# EAGLE design pcb_univ_3-(1-3-5)-x-x-rev5 (EAGLE 9.6.2)
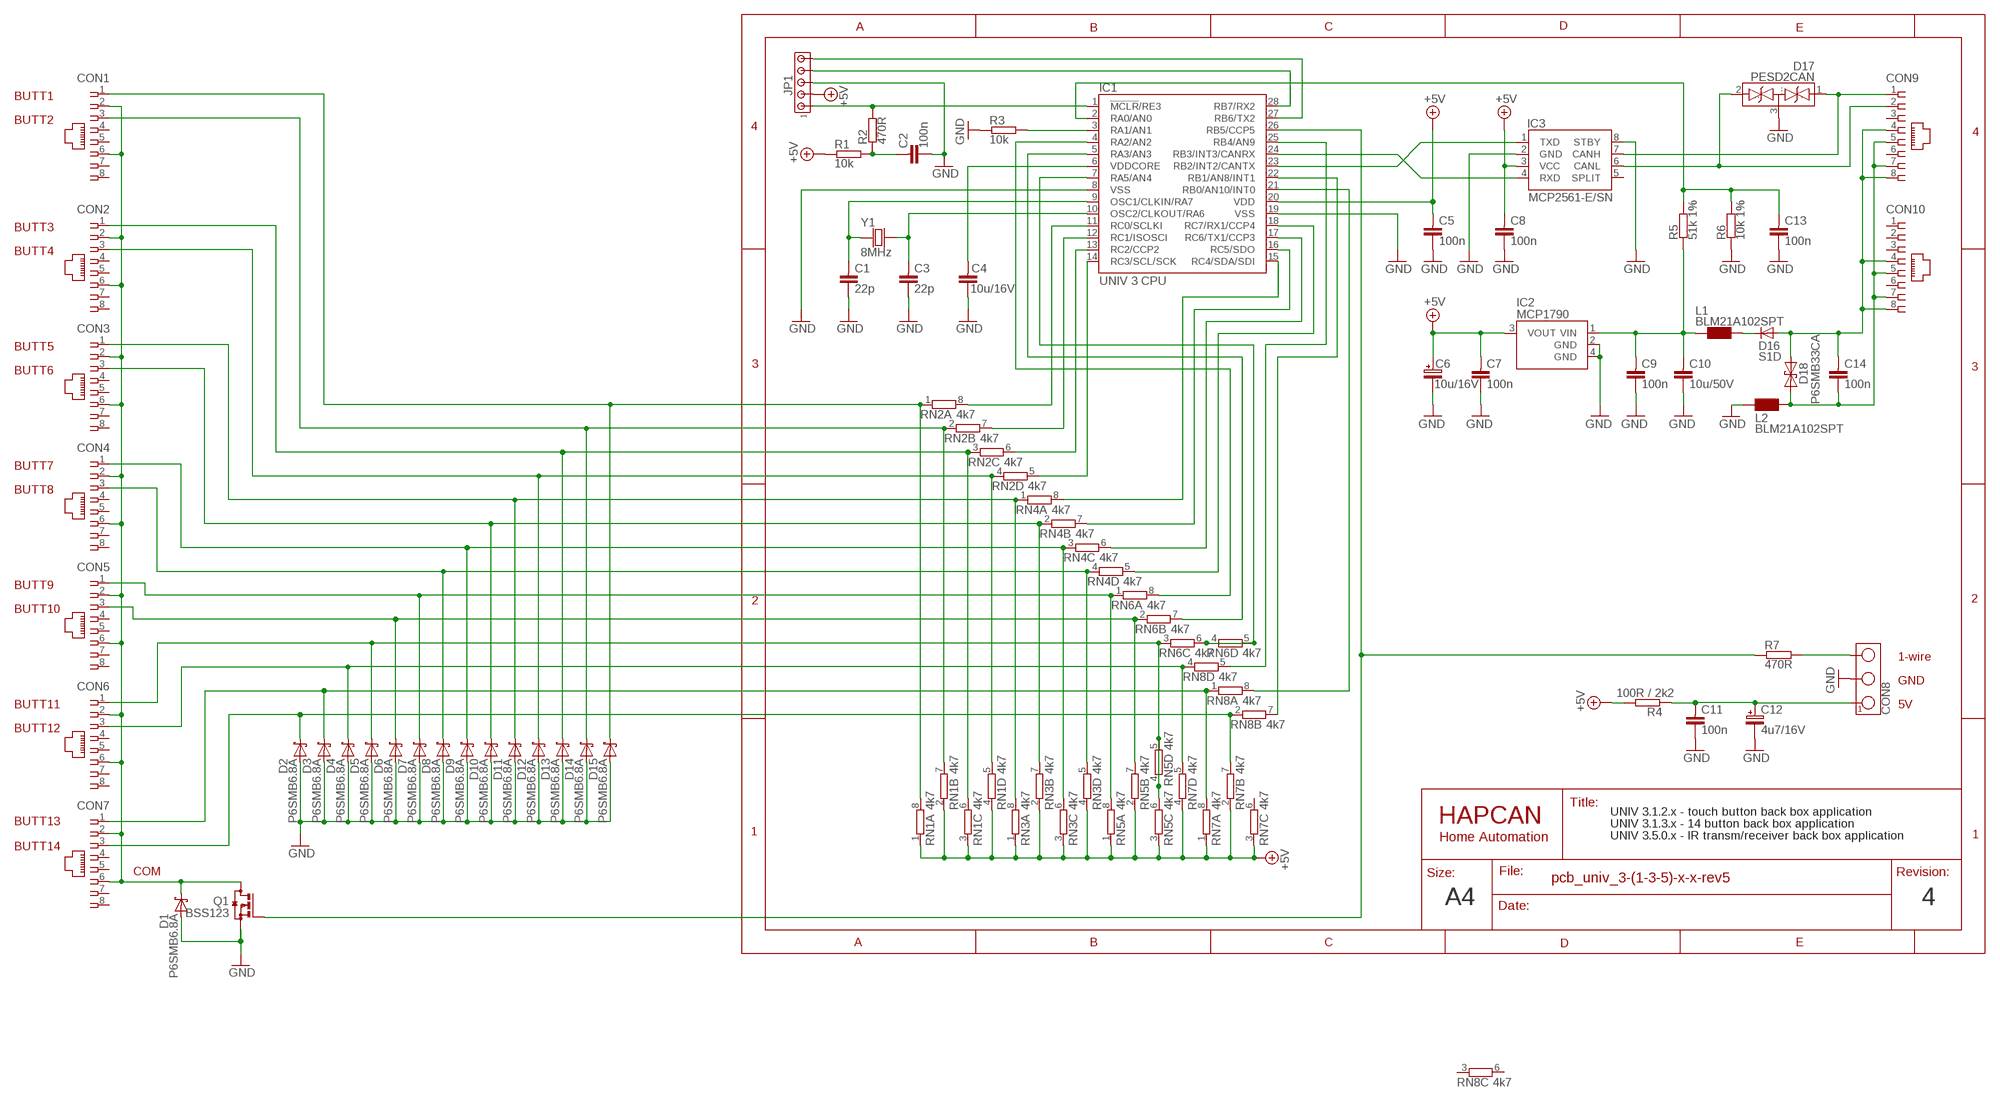
[diagram p0: schematic, sheet 1]

## Parts
C1  22p  CAPACITOR0805  [0805]
C2  100n  CAPACITOR0805  [0805]
C3  22p  CAPACITOR0805  [0805]
C4  10u/16V  CAPACITOR0805  [0805]
C5  100n  CAPACITOR0805  [0805]
C6  10u/16V  CAPACITOR-POLARIZED-SMC_B  [SMC_B]
C7  100n  CAPACITOR0805  [0805]
C8  100n  CAPACITOR0805  [0805]
C9  100n  CAPACITOR0805  [0805]
C10  10u/50V  CAPACITOR1210  [1210]
C11  100n  CAPACITOR0805  [0805]
C12  4u7/16V  CAPACITOR-POLARIZED-SMC_B  [SMC_B]
C13  100n  CAPACITOR0805  [0805]
C14  100n  CAPACITOR0805  [0805]
CON1  RJ45-SOCKET  [RJ45-PCB-SOCKET]
CON2  RJ45-SOCKET  [RJ45-PCB-SOCKET]
CON3  RJ45-SOCKET  [RJ45-PCB-SOCKET]
CON4  RJ45-SOCKET  [RJ45-PCB-SOCKET]
CON5  RJ45-SOCKET  [RJ45-PCB-SOCKET]
CON6  RJ45-SOCKET  [RJ45-PCB-SOCKET]
CON7  RJ45-SOCKET  [RJ45-PCB-SOCKET]
CON8  TERMINAL-3  TERMINAL-3-5X10.5MM  [ARK3-5X10.5MM]
CON9  RJ45-SOCKET  [RJ45-PCB-SOCKET]
CON10  RJ45-SOCKET  [RJ45-PCB-SOCKET]
D1  P6SMB6.8A  DIODE_TRANSIL1_DO214  [DO-214]
D2  P6SMB6.8A  DIODE_TRANSIL1_DO214  [DO-214]
D3  P6SMB6.8A  DIODE_TRANSIL1_DO214  [DO-214]
D4  P6SMB6.8A  DIODE_TRANSIL1_DO214  [DO-214]
D5  P6SMB6.8A  DIODE_TRANSIL1_DO214  [DO-214]
D6  P6SMB6.8A  DIODE_TRANSIL1_DO214  [DO-214]
D7  P6SMB6.8A  DIODE_TRANSIL1_DO214  [DO-214]
D8  P6SMB6.8A  DIODE_TRANSIL1_DO214  [DO-214]
D9  P6SMB6.8A  DIODE_TRANSIL1_DO214  [DO-214]
D10  P6SMB6.8A  DIODE_TRANSIL1_DO214  [DO-214]
D11  P6SMB6.8A  DIODE_TRANSIL1_DO214  [DO-214]
D12  P6SMB6.8A  DIODE_TRANSIL1_DO214  [DO-214]
D13  P6SMB6.8A  DIODE_TRANSIL1_DO214  [DO-214]
D14  P6SMB6.8A  DIODE_TRANSIL1_DO214  [DO-214]
D15  P6SMB6.8A  DIODE_TRANSIL1_DO214  [DO-214]
D16  S1D  DIODE_DO-214  [DO-214]
D17  PESD2CAN  PESD2CANSOT-23  [SOT-23]
D18  P6SMB33CA  DIODE_TRANSIL2  [DO-214_TRANSIL2]
IC1  UNIV 3 CPU  UNIV3CPU-I/SO  [UNIV3CPU]
IC2  MCP1790  [SOT-223]
IC3  MCP2561-E/SN  [SO-08]
JP1  HEADER5  [SIP-5]
L1  BLM21A102SPT  BLMXXX  [0805@1]
L2  BLM21A102SPT  BLMXXX  [0805@1]
Q1  BSS123  [SOT23]
R1  10k  RESISTOR0805  [0805]
R2  470R  RESISTOR0805  [0805]
R3  10k  RESISTOR0805  [0805]
R4  100R / 2k2  RESISTOR0805  [0805]
R5  51k 1%  RESISTOR0805  [0805]
R6  10k 1%  RESISTOR0805  [0805]
R7  470R  RESISTOR0805  [0805]
RN1  4k7  4R-NEXB38V  [EXB38V]
RN2  4k7  4R-NEXB38V  [EXB38V]
RN3  4k7  4R-NEXB38V  [EXB38V]
RN4  4k7  4R-NEXB38V  [EXB38V]
RN5  4k7  4R-NEXB38V  [EXB38V]
RN6  4k7  4R-NEXB38V  [EXB38V]
RN7  4k7  4R-NEXB38V  [EXB38V]
RN8  4k7  4R-NEXB38V  [EXB38V]
Y1  8MHz  CRYSTAL-HC49V  [CRYSTAL-HC49V]

## Nets
+5V: C5.1 C6.+ C7.1 C8.1 IC1.20(VDD) IC2.3(VOUT) IC3.3(VCC) JP1.2 R1.1 R4.1 RN1.1 RN1.2 RN1.3 RN1.4 RN3.1 RN3.2 RN3.3 RN3.4 RN5.1 RN5.2 RN5.3 RN7.1 RN7.2 RN7.3 RN7.4
GND: C1.2 C2.2 C3.2 C4.2 C5.2 C6.- C7.2 C8.2 C9.2 C10.2 C11.2 C12.- C13.2 CON8.2 D1.A D2.A D3.A D4.A D5.A D6.A D7.A D8.A D9.A D10.A D11.A D12.A D13.A D14.A D15.A D17.3(...) IC1.8(VSS) IC1.19(VSS) IC2.2(GND) IC2.4(GND) IC3.2(GND) IC3.8(STBY) JP1.3 L2.1 Q1.2(S) R3.1 R6.1
N$1: IC1.26(RB5/CCP5) Q1.1(G) R7.1
N$2: IC1.24(RB3/INT3/CANRX) IC3.4(RXD)
N$3: IC1.23(RB2/INT2/CANTX) IC3.1(TXD)
N$4: IC1.7(RA5/AN4) RN6.4 RN6.5 RN6.6
N$5: CON1.1 D15.C RN1.8 RN2.1
N$6: CON2.1 D13.C RN1.6 RN2.3
N$7: C2.1 R1.2 R2.1
N$8: IC1.1(!MCLR!/RE3) JP1.1 R2.2
N$9: CON9.1 D17.1(.) IC3.7(CANH)
N$10: IC1.28(RB7/RX2) JP1.4
N$11: IC1.22(RB1/AN8/INT1) RN8.7
N$12: IC1.3(RA1/AN1) R3.2
N$13: CON5.1 D7.C RN5.8 RN6.1
N$14: IC1.27(RB6/TX2) JP1.5
N$15: C3.1 IC1.10(OSC2/CLKOUT/RA6) Y1.2
N$16: C13.1 IC1.2(RA0/AN0) R5.2 R6.2
N$17: C9.1 C10.1 IC2.1(VIN) L1.1 R5.1
N$18: IC1.21(RB0/AN10/INT0) RN8.8
N$19: CON1.3 D14.C RN1.7 RN2.2
N$20: IC1.25(RB4/AN9) RN8.5
N$21: CON2.3 D12.C RN1.5 RN2.4
N$22: IC1.14(RC3/SCL/SCK) RN2.5
N$23: CON3.3 D10.C RN3.7 RN4.2
N$24: CON4.1 D9.C RN3.6 RN4.3
N$25: IC1.11(RC0/SCLKI) RN2.8
N$26: IC1.12(RC1/ISOSCI) RN2.7
N$27: IC1.13(RC2/CCP2) RN2.6
N$28: CON5.3 D6.C RN5.7 RN6.2
N$29: IC1.15(RC4/SDA/SDI) RN4.8
N$30: CON8.3 R7.2
N$31: CON3.1 D11.C RN3.8 RN4.1
N$32: CON4.3 D8.C RN3.5 RN4.4
N$33: IC1.5(RA3/AN3) RN6.7
N$34: IC1.4(RA2/AN2) RN6.8
N$36: CON6.1 D5.C RN5.4 RN5.5 RN5.6 RN6.3
N$37: C11.1 C12.+ CON8.1 R4.2
N$38: CON6.3 D4.C RN7.5 RN8.4
N$39: C14.2 CON9.5 CON9.7 CON10.5 CON10.7 D18.C L2.2
N$40: C1.1 IC1.9(OSC1/CLKIN/RA7) Y1.1
N$41: CON7.3 D2.C RN7.7 RN8.2
N$42: CON9.2 D17.2(..) IC3.6(CANL)
N$45: IC1.16(RC5/SDO) RN4.7
N$46: IC1.17(RC6/TX1/CCP3) RN4.6
N$47: IC1.18(RC7/RX1/CCP4) RN4.5
N$48: CON7.1 D3.C RN7.8 RN8.1
N$51: CON1.2 CON1.6 CON2.2 CON2.6 CON3.2 CON3.6 CON4.2 CON4.6 CON5.2 CON5.6 CON6.2 CON6.6 CON7.2 CON7.6 D1.C Q1.3(D)
N$56: C4.1 IC1.6(VDDCORE)
N$64: C14.1 CON9.4 CON9.8 CON10.4 CON10.8 D16.A D18.A
N$67: D16.C L1.2
Unconnected: CON1.4 CON1.5 CON1.7 CON1.8 CON2.4 CON2.5 CON2.7 CON2.8 CON3.4 CON3.5 CON3.7 CON3.8 CON4.4 CON4.5 CON4.7 CON4.8 CON5.4 CON5.5 CON5.7 CON5.8 CON6.4 CON6.5 CON6.7 CON6.8 CON7.4 CON7.5 CON7.7 CON7.8 CON9.3 CON9.6 CON10.1 CON10.2 CON10.3 CON10.6 IC3.5(SPLIT) RN7.6 RN8.3 RN8.6

## Notes on the sheet
- BUTT1
- BUTT2
- BUTT3
- BUTT4
- BUTT5
- BUTT6
- BUTT7
- BUTT8
- BUTT9
- BUTT10
- 1-wire
- GND
- BUTT11 | 5V
- BUTT12
- UNIV 3.1.2.x - touch button back box application
- BUTT13 | UNIV 3.1.3.x - 14 button back box application
- UNIV 3.5.0.x - IR transm/receiver back box application
- BUTT14
- COM
- A4 | 4

## Library data of the parts
C1-C5 C7-C11 C13 C14 = HAPCAN_devices - UNIV3:CAPACITOR: HAPCAN Capacitor
C6 C12 = HAPCAN_devices - UNIV3:CAPACITOR-POLARIZED: HAPCAN Polarazied Capacitor
CON1-CON7 CON9 CON10 = HAPCAN_devices - UNIV3:RJ45-SOCKET: HAPCAN RJ45 socket
CON8 = HAPCAN_devices - UNIV3:TERMINAL-3: HAPCAN Terminal Block - 3 way
D1-D15 = HAPCAN_devices - UNIV3:DIODE_TRANSIL1: HAPCAN Unidirectional transil diode
D16 = HAPCAN_devices - UNIV3:DIODE: HAPCAN Rectifier Diode
D17 = HAPCAN_devices - UNIV3:PESD2CAN: CAN bus ESD protection diode
D18 = HAPCAN_devices - UNIV3:DIODE_TRANSIL2: HAPCAN Bidirectional transil diode
IC1 = HAPCAN_devices - UNIV3:UNIV3CPU: HAPCAN Microcontroller UNIV 3 CPU
IC2 = HAPCAN_devices - UNIV3:MCP1790: 70 mA, High Voltage Regulator
IC3 = HAPCAN_devices - UNIV3:MCP2561: HAPCAN CAN Tranceiver
JP1 = HAPCAN_devices - UNIV3:HEADER5: HAPCAN Header 5
L1 L2 = HAPCAN_devices - UNIV3:BLMXXX: Choke
Q1 = transistor-small-signal:BSS123: N-CHANNEL MOS FET
R1-R7 = HAPCAN_devices - UNIV3:RESISTOR: HAPCAN Resistor
RN1-RN8 = resistor-dil:4R-N: Array Chip Resistor Source: RS Component / Phycomp; OC_FARNELL: unknown; OC_NEWARK: unknown
Y1 = HAPCAN_devices - UNIV3:CRYSTAL: HAPCAN Crystal

## Board
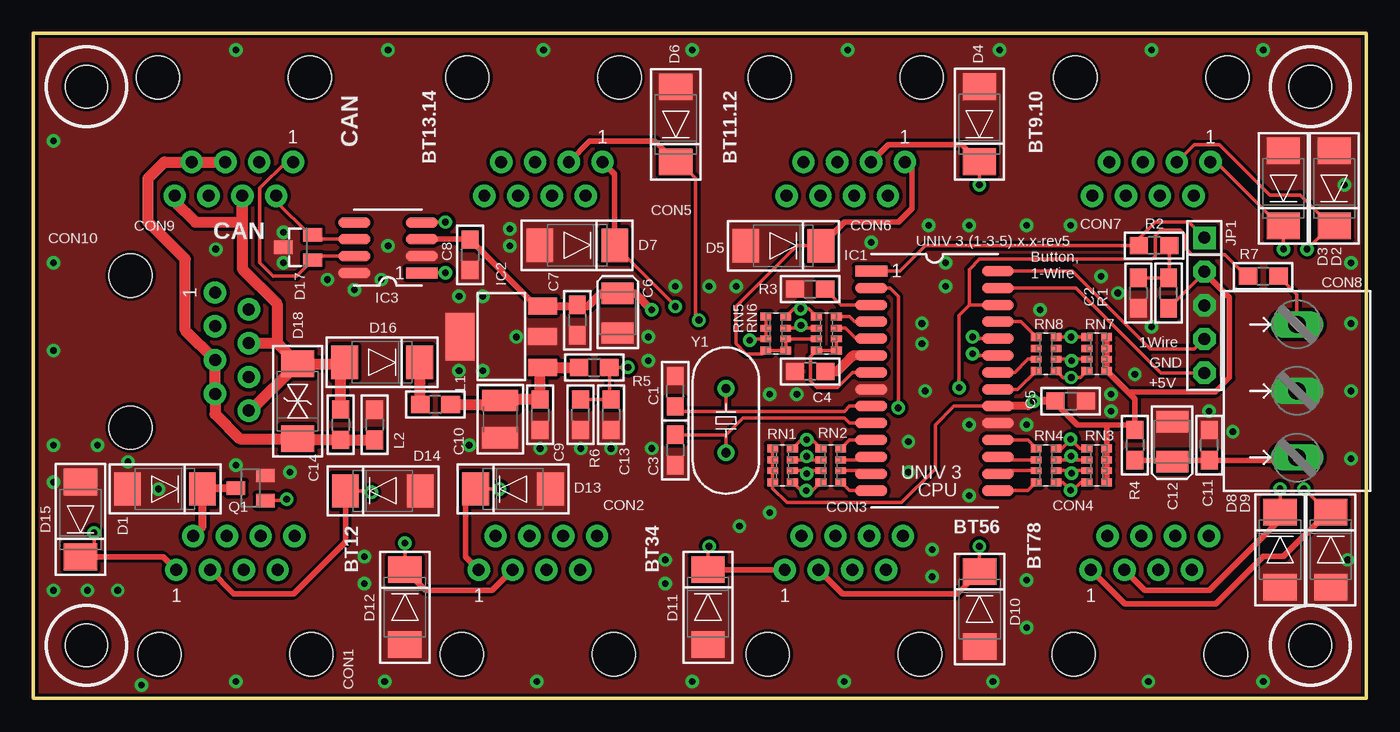
[diagram p1: board, top side]
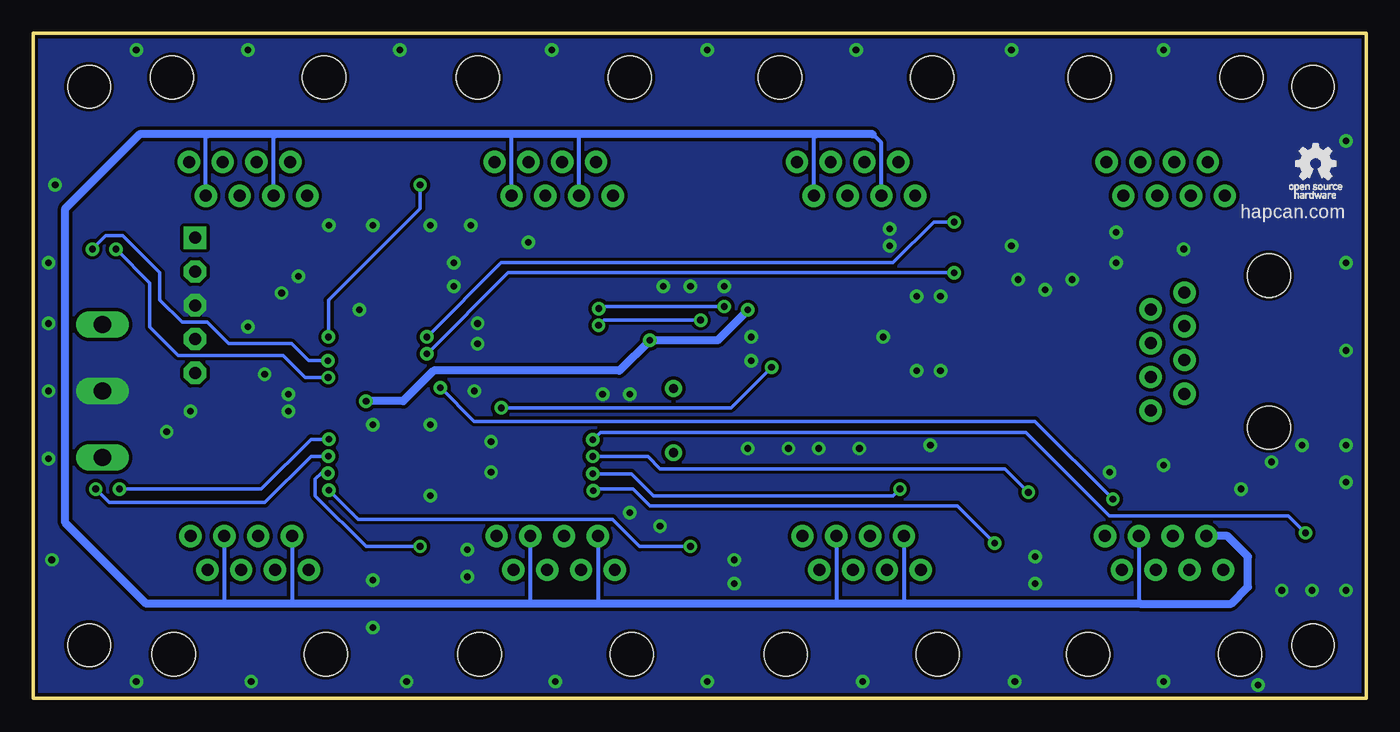
[diagram p2: board, bottom side, seen from below]

Size 100.2 x 50.02 mm. Coordinates in mm from the lower left corner, seen from the top.
Outline: 0,0 100.2,0 100.2,50.02 0,50 0,0
Copper layers (1*16): Top 0.035mm / dielectric 1.5mm / Bottom 0.035mm
Design rules "hapcan_drc *": minimum track width 10mil, minimum drill 0.5mm, track to track 10mil, track to pad 10mil, pad to pad 10mil, via to via 10mil, smd to smd 0mil, copper to edge 10mil, drill to drill 8mil, minimum pad ring 10mil, minimum via ring 10mil, stop-mask expansion 4mil, vias tented up to drill 0.7mm, thermal gap 0mil
Holes 3.2 mm at 4,46 4,4 96,46 96,4

### Footprints (pad centres in the part's own frame; a part is rotated, then mirrored left to right if it is on the bottom)
0805 = smd 1.372 x 1.27: 1 -1.143,0; 2 1.143,0
SMC_B = smd 1.6 x 2.4: + -1.5,0; - 1.5,0
1210 = smd 1.6 x 2.7: 1 -1.4,0; 2 1.4,0
RJ45-PCB-SOCKET = drill 0.9 pad 1.676: 1 -4.445,6.35; 2 -3.175,8.89; 3 -1.905,6.35; 4 -0.635,8.89; 5 0.635,6.35; 6 1.905,8.89; 7 3.175,6.35; 8 4.445,8.89 | hole 3.251: -5.715,0; 5.715,0
ARK3-5X10.5MM = drill 1.3 pad 2 long: 1 -5,0; 2 0,0; 3 5,0
DO-214 = smd 2 x 2.5: A 2.82,0; C -2.82,0
SOT-23 = smd 1 x 1.4: 1 -0.95,-1.1; 2 0.95,-1.1; 3 0,1.1
DO-214_TRANSIL2 = smd 2 x 2.5: A 2.82,0; C -2.82,0
UNIV3CPU = smd 2.4 x 0.8: 1 -4.763,8.255; 2 -4.763,6.985; 3 -4.763,5.715; 4 -4.763,4.445; 5 -4.763,3.175; 6 -4.763,1.905; 7 -4.763,0.635; 8 -4.763,-0.635; 9 -4.763,-1.905; 10 -4.763,-3.175; 11 -4.763,-4.445; 12 -4.763,-5.715; 13 -4.763,-6.985; 14 -4.763,-8.255; 15 4.763,-8.255; 16 4.763,-6.985; 17 4.763,-5.715; 18 4.763,-4.445; 19 4.763,-3.175; 20 4.763,-1.905; 21 4.763,-0.635; 22 4.763,0.635; 23 4.763,1.905; 24 4.763,3.175; 25 4.763,4.445; 26 4.763,5.715; 27 4.763,6.985; 28 4.763,8.255
SOT-223 = smd 1.27 x 2.159: 1 -2.311,-3.099; 2 0,-3.099; 3 2.311,-3.099 | smd 3.556 x 2.159: 4 0,3.099
SO-08 = smd 2.4 x 0.8: 1 -2.54,1.905; 2 -2.54,0.635; 3 -2.54,-0.635; 4 -2.54,-1.905; 5 2.54,-1.905; 6 2.54,-0.635; 7 2.54,0.635; 8 2.54,1.905
SIP-5 = drill 0.9 pad 1.676 square: 1 -5.08,0 | drill 0.9 pad 1.676 octagon: 2 -2.54,0; 3 0,0; 4 2.54,0; 5 5.08,0
0805@1 = smd 1.397 x 1.27: 1 -1.143,0; 2 1.143,0
SOT23 = smd 1 x 1.4: 1 -0.95,-1.1; 2 0.95,-1.1; 3 0,1.1
EXB38V = smd 0.6 x 0.8: 1 -1.275,-0.75; 4 1.275,-0.75; 5 1.275,0.75; 8 -1.275,0.75 | smd 0.5 x 0.8: 2 -0.4,-0.75; 3 0.4,-0.75; 6 0.4,0.75; 7 -0.4,0.75
CRYSTAL-HC49V = drill 0.7 pad 1.27: 1 -2.413,0; 2 2.413,0

### Placement (x,y rotation side)
C1  48.26,23.1 90 top
C2  83.06,30.48 270 top
C3  48.26,18.68 270 top
C4  58.41,24.59 180 top
C5  77.98,22.35 0 top
C6  43.92,28.97 270 top
C7  40.89,28.45 270 top
C8  32.83,33.35 270 top
C9  38.1,21.34 270 top
C10  35.11,21 270 top
C11  88.39,19.05 90 top
C12  85.61,19.3 90 top
C13  43.43,21.34 270 top
C14  23.11,20.57 270 top
CON1  15.19,3.31 0 top
CON2  37.93,3.31 0 top
CON3  60.93,3.31 0 top
CON4  83.93,3.31 0 top
CON5  38.35,46.69 180 top
CON6  61.07,46.69 180 top
CON7  84.05,46.69 180 top
CON8  95,23.11 90 top
CON9  15.08,46.69 180 top
CON10  7.31,26.08 270 top
D1  9.91,15.75 180 top
D2  97.79,38.35 90 top
D3  93.97,38.35 90 top
D4  71.12,43.18 90 top
D5  56.39,34.04 180 top
D6  48.3,43.16 90 top
D7  40.88,34.08 180 top
D8  93.73,11.18 270 top
D9  97.54,11.18 270 top
D10  71.13,6.72 270 top
D11  50.72,6.86 270 top
D12  27.94,6.86 270 top
D13  36.07,15.75 0 top
D14  26.28,15.61 0 top
D15  3.56,13.46 90 top
D16  26.22,25.27 180 top
D17  19.9,33.92 90 top
D18  19.87,22.34 90 top
IC1  67.75,23.88 0 top
IC2  35.18,27.2 90 top
IC3  26.67,33.89 180 top
JP1  88.04,29.56 270 top
L1  30.23,22.1 180 top
L2  25.65,20.57 270 top
Q1  16.34,15.82 90 top
R1  85.34,30.48 90 top
R2  84.25,34.06 180 top
R3  58.39,30.77 0 top
R4  82.8,19.05 270 top
R5  42.16,24.89 0 top
R6  41.15,21.34 90 top
R7  92.46,31.75 0 top
RN1  56.32,17.53 270 top
RN2  59.96,17.53 270 top
RN3  79.95,17.53 90 top
RN4  76.14,17.53 90 top
RN5  55.82,27.43 270 top
RN6  59.63,27.43 270 top
RN7  79.95,25.91 90 top
RN8  76.14,25.91 90 top
Y1  52.07,20.89 270 top

### Tracks (layer width: path | path; a pad name or v marks a point on that pad's centre or on a via)
+5V  (via drill 0.5)
  Top 0.254: R1.1 88.04,32.03 JP1.2 | RN1.1 RN1.2 RN1.3 RN1.4 55.57,15.8 56.64,14.73 65.28,14.73 67.82,17.27 67.82,20.57 69.22,21.97 IC1.20 | RN5.3 53.96,27.03 v53.85,26.92 | C7.1 38.35,29.59 IC2.3 | RN5.3 RN5.1 | RN5.2 RN5.3
  Top 0.406: 82.42,20.57 R4.1 | 80.7,20.57 82.42,20.57 | 82.42,20.57 82.8,20.57 82.8,22.52 82.27,23.06 | RN3.3 RN3.4 80.7,20.57 | RN3.3 RN3.1 | 82.27,23.06 RN7.1 RN7.2 RN7.3 RN7.4 | C5.1 76.83,22.23 78.49,20.57 80.7,20.57 | IC3.3 32.8,34.52 C8.1 37.81,29.51 IC2.3 | 82.27,23.06 88.84,23.06 89.92,24.13 89.92,30.15 88.04,32.03 | RN3.2 RN3.3
  Top 0.61: v46.48,29.21 45.22,30.47 C6.+ 42.67,30.48 41.71,29.51 IC2.3 | C5.1 v75.18,22.35 74.8,21.97 IC1.20
  Bottom 0.61: v75.18,22.35 72.39,22.35 70.1,24.64 56.13,24.64 v53.85,26.92 48.77,26.92 v46.48,29.21
GND  (via drill 0.5)
  other vias: 18.8,32.77 18.8,35.05 26.16,31.5 22.1,31.5 24.13,30.73 35.81,35.31 35.81,34.04 32,30.23 33.78,30.23 32,24.64 33.78,24.64 32.77,19.05 38.1,18.8 41.15,18.8 43.43,18.8 46.48,18.8 55.37,13.97 53.09,12.95 15.24,17.53 19.3,17.02 26.67,34.04 36.32,27.18 46.23,27.18 46.23,25.4 48.26,30.99 50.8,30.99 52.83,30.99 57.4,22.86 55.37,22.86 70.36,20.57 74.68,20.57 70.36,15.24 65.79,19.3 65.79,17.02 67.06,23.11 66.8,26.67 66.8,28.19 68.58,30.99 68.58,32.77 62.99,34.29 67.31,35.56 70.36,35.56 74.68,35.56 77.98,35.56 80.26,31.75 81.53,30.48 88.39,21.59 90.17,20.07 84.07,27.94 99.06,18.03 99.06,23.11 99.06,28.19 99.06,32.77 98.55,38.61 92.46,48.77 84.07,48.77 72.64,48.77 61.21,48.77 49.53,48.77 38.35,48.77 26.67,48.77 15.24,48.77 1.52,41.91 1.52,32.77 1.52,26.16 1.52,19.05 1.52,16.26 7.11,17.78 9.4,15.75 1.52,8.13 8.13,1.02 15.24,1.27 26.42,1.27 37.85,1.27 49.53,1.27 60.96,1.27 72.14,1.27 83.82,1.27 92.46,1.27 98.81,10.41 13.72,33.78 75.69,29.21 82.8,24.38 4.06,8.13 6.35,8.13 4.83,19.05 24.89,8.64 24.89,10.67 47.5,10.41 47.5,8.64 67.56,11.18 67.56,9.14 74.68,8.89 74.68,5.33 81.03,21.59 81.03,22.86
  pour Top (isolate 0.254): 99.94,49.78 99.94,0.25 0.29,0.25 0.29,49.78
  pour Bottom (isolate 0.254): 0.25,0.25 99.82,0.25 99.82,49.78 0.25,49.78
N$1  (via drill 0.5)
  Top 0.254: Q1.1 18.93,14.87 v19.05,14.99 | v69.6,23.37 69.6,28.8 70.38,29.59 | 70.38,29.59 70.36,29.62 70.36,32.26 71.12,33.02 84.07,33.02 84.33,33.27 84.33,34.8 84.73,35.2 86.21,35.2 86.61,34.8 86.61,33.78 86.68,33.78 87.09,33.37 89.57,33.37 91.19,31.75 R7.1 | IC1.26 70.38,29.59
  Bottom 0.254: v19.05,14.99 24.89,20.83 67.06,20.83 v69.6,23.37
N$2  (via drill 0.5)
  Top 0.254: IC1.24 70.74,27.05 v70.61,27.18 | v30.99,35.81 29.23,35.81 IC3.4
  Bottom 0.254: v70.61,27.18 65.02,32.77 35.56,32.77 32.51,35.81 v30.99,35.81
N$3  (via drill 0.5)
  Top 0.254: IC1.23 70.74,25.78 v70.61,25.91 | v30.99,32 29.23,32 IC3.1
  Bottom 0.254: v70.61,25.91 64.52,32 v30.99,32
N$4
  Top 0.254: RN6.6 RN6.5 RN6.4 58.42,25.7 58.42,23.88 58.93,23.37 60.45,23.37 61.59,24.51 IC1.7
N$5  (via drill 0.5)
  Top 0.254: RN1.8 57.73,19.45 v58.14,19.45 58.55,19.45 RN2.1 | v4.57,12.45 4.57,11.66 D15.C
  Top 0.406: CON1.1 9.77,10.64 D15.C
  Bottom 0.254: v4.57,12.45 5.84,13.72 19.3,13.72 25.59,20 57.57,20 58.12,19.45 v58.14,19.45
N$6  (via drill 0.5)
  Top 0.254: RN1.6 57.99,17.13 58.14,16.98 v58.14,16.89 58.38,17.13 RN2.3 | D13.C v35.05,15.75
  Top 0.406: CON2.1 32.51,10.64 32.51,15.01 D13.C
  Bottom 0.254: v35.05,15.75 35.56,15.24 53.59,15.24 55.24,16.89 v58.14,16.89
N$7
  Top 0.254: R2.1 85.39,31.67 R1.2 C2.1
N$8
  Top 0.254: IC1.1 65.15,32.13 67.08,34.06 R2.2 83.11,34.57 84.35,35.81 86.86,35.81 JP1.1
N$9
  Top 0.254: IC3.7 21.29,33.26 D17.1 19.78,31.75 18.03,31.75 17.02,32.77 17.02,38.35 19,40.34 CON9.1
N$10
  Top 0.254: JP1.4 87.27,26.25 83.98,26.25 78.11,32.13 IC1.28
N$11
  Top 0.254: RN8.7 74.78,25.51 73.79,24.51 IC1.22
N$12
  Top 0.254: IC1.3 60.72,29.59 R3.2
N$13  (via drill 0.5)
  Top 0.254: RN5.8 57.17,29.31 v57.68,29.31 58.27,29.31 RN6.1 | D7.C 48.26,29.52 v48.26,29.46
  Top 0.406: CON5.1 43.7,39.43 D7.C
  Bottom 0.254: v48.26,29.46 57.53,29.46 v57.68,29.31
N$14
  Top 0.254: JP1.5 84.74,24.48 78.36,30.86 IC1.27
N$15
  Top 0.254: IC1.10 61.34,20.7 60.96,21.08 53.34,21.08 52.07,19.81 Y1.2 52.07,19.82 48.27,19.82
  Top 0.406: 48.27,19.81 48.27,19.82 C3.1
N$16  (via drill 0.5)
  Top 0.254: R6.2 C13.1 43.31,22.61 R5.2 v44.7,24.89 | v65.02,21.84 65.02,30.23 64.39,30.86 IC1.2
  Bottom 0.254: v44.7,24.89 47.75,21.84 v65.02,21.84
N$17
  Top 0.254: C10.1 35.11,22.15 35.05,22.1
  Top 0.813: L1.1 35.05,22.1 35.56,22.1 35.94,22.48 C9.1 38.1,24.71 IC2.1 R5.1 | R5.1
N$18
  Top 0.254: RN8.8 73.99,23.24 IC1.21
N$19  (via drill 0.5)
  Top 0.254: RN1.7 57.87,17.93 v58.14,18.19 58.4,17.93 RN2.2 | D14.C 25.29,15.61 v25.4,15.49
  Top 0.406: CON1.3 15.07,7.87 19.56,7.87 23.46,11.78 D14.C
  Bottom 0.254: v25.4,15.49 27.18,17.27 53.09,17.27 54.01,18.19 v58.14,18.19
N$20
  Top 0.254: IC1.25 74.25,28.32 RN8.5
N$21  (via drill 0.5)
  Top 0.254: RN1.5 57.7,15.63 v58.09,15.63 58.59,15.63 RN2.4 | D12.C v27.94,11.68
  Top 0.406: D12.C 29.49,8.13 34.49,8.13 CON2.3
  Bottom 0.254: v27.94,11.68 30.73,14.48 53.85,14.48 55.12,15.75 57.97,15.75 v58.09,15.63
N$22
  Top 0.254: RN2.5 61.34,15.62 IC1.14
N$23  (via drill 0.5)
  Top 0.254: RN4.2 77.84,17.13 v78.04,16.93 78.24,17.13 RN3.7 | D10.C 71.13,11.42 v71.12,11.43
  Top 0.406: CON3.3 60.82,7.87 69.47,7.87 D10.C
  Bottom 0.254: v78.04,16.93 78.58,16.93 78.99,16.51 78.99,15.24 75.18,11.43 v71.12,11.43
N$24  (via drill 0.5)
  Top 0.254: RN4.3 77.73,17.93 v78.02,18.21 78.3,17.93 RN3.6 | D9.C 97.28,14 95.53,15.75 v95.5,15.75
  Top 0.406: CON4.1 82.04,7.11 88.9,7.11 92.46,10.67 93.98,10.67 97.31,14 D9.C
  Bottom 0.254: v95.5,15.75 94.49,14.73 82.8,14.73 79.33,18.21 v78.02,18.21
N$25
  Top 0.254: RN2.8 61.34,19.43 IC1.11
N$26
  Top 0.254: RN2.7 62.76,17.93 IC1.12
N$27
  Top 0.254: RN2.6 62.76,17.13 IC1.13
N$28  (via drill 0.5)
  Top 0.254: RN6.2 57.93,27.83 v57.71,28.05 57.49,27.83 RN5.7 | D6.C 48.55,40.34 49.78,39.11 49.78,28.7 v50.04,28.45
  Top 0.406: CON5.3 41.83,41.91 46.73,41.91 D6.C
  Bottom 0.254: v50.04,28.45 57.3,28.45 57.32,28.43 57.33,28.43 v57.71,28.05
N$29
  Top 0.254: RN4.8 74.76,15.62 IC1.15
N$30
  Top 0.254: R7.2 95,30.35 CON8.3
N$31  (via drill 0.5)
  Top 0.254: RN4.1 77.41,16.25 v77.99,15.67 78.15,15.67 78.73,16.25 RN3.8 | D11.C 50.72,11.35 v50.8,11.43
  Top 0.406: CON3.1 50.74,9.66 D11.C
  Bottom 0.254: v77.99,15.67 75.78,13.46 56.64,13.46 54.61,11.43 v50.8,11.43
N$32  (via drill 0.5)
  Top 0.254: RN4.4 77.31,18.8 v77.99,19.48 78.38,19.09 78.68,18.8 RN3.5 | v93.73,15.75 D8.C
  Top 0.406: CON4.3 83.56,8.13 88.39,8.13 93.73,13.46 D8.C
  Bottom 0.254: v93.73,15.75 83.06,15.75 79.32,19.48 v77.99,19.48
N$33
  Top 0.254: RN6.7 61.07,27.83 61.85,27.05 IC1.5
N$34
  Top 0.254: RN6.8 61.34,28.71 61.72,28.32 IC1.4
N$36
  Top 0.254: RN6.3 RN5.6 RN5.5 RN5.4 54.82,25.91 53.59,25.91 52.83,26.67 52.83,29.46 57.4,34.04 D5.C
  Top 0.406: CON6.1 66.04,39.81 66.04,36.83 65.02,35.81 60.99,35.81 D5.C
N$37
  Top 0.406: R4.2 C11.1 | C11.1 94.79,17.91 CON8.1 | C12.+ 85.72,17.91 C11.1
N$38  (via drill 0.5)
  Top 0.254: RN8.4 v78,27.18 | v78,27.18 | RN7.5 v78,27.18 | D4.C v71.12,38.61
  Top 0.406: CON6.3 64.3,41.66 69.82,41.66 D4.C
  Bottom 0.254: v71.12,38.61 71.12,36.83 78,29.95 v78,27.18
N$39
  Top 0.813: CON9.5 CON9.7 9.86,40.34 8.64,39.12 8.64,35.81 11.43,33.02 11.43,27.68 CON10.5 CON10.7 13.66,21.39 15.53,19.52 D18.C 19.96,19.43 C14.2 L2.2
N$40
  Top 0.254: IC1.9 61.34,21.97 60.96,21.59 52.07,21.59 | C1.1 48.63,21.59 52.07,21.59 | Y1.1 52.07,21.59
N$41  (via drill 0.5)
  Top 0.254: RN8.2 77.95,25.51 v78.05,25.4 78.16,25.51 RN7.7 | CON7.3 87.28,41.66 89.15,41.66 92.96,37.85 95.22,37.85 97.54,35.53 | 97.54,35.53 D2.C | 97.54,35.53 95.78,33.78 v95.76,33.78
  Bottom 0.254: v95.76,33.78 94.74,34.8 93.47,34.8 90.68,32 90.68,29.97 89,28.3 87.12,28.3 85.5,26.67 80.77,26.67 79.5,25.4 v78.05,25.4
N$42
  Top 0.254: CON9.2 18.25,37.37 20.76,34.87 D17.2 21.34,34.52 IC3.6
N$45
  Top 0.254: RN4.7 72.75,17.13 IC1.16
N$46
  Top 0.254: RN4.6 72.75,17.93 IC1.17
N$47
  Top 0.254: RN4.5 74.76,19.43 74.17,19.43 IC1.18
N$48  (via drill 0.5)
  Top 0.254: RN8.1 77.39,24.13 v78.03,24.13 78.69,24.13 RN7.8 | CON7.1 88.92,40.34 93.72,35.53 D3.C v93.98,33.78
  Bottom 0.254: v93.98,33.78 91.44,31.24 91.44,27.94 89.3,25.8 81.42,25.8 79.76,24.13 v78.03,24.13
N$51
  Top 0.406: 12.73,13.72 12.73,13.97
  Top 0.61: CON1.2 12.73,12.91 12.73,13.72 | 12.73,13.97 D1.C 12.8,15.82 Q1.3
  Bottom 0.305: CON5.6 36.45,41.78 37.08,42.42 | CON5.2 41.53,42.29 41.4,42.42 | CON6.6 59.17,42.41 59.18,42.42 | CON6.2 64.25,42.41 64.26,42.42 | CON7.6 82.14,42.31 82.04,42.42 | CON7.2 87.22,42.31 87.12,42.42 | CON4.6 85.85,12.19 85.85,7.11 | CON4.2 80.75,7.13 80.77,7.11 | CON3.6 62.84,7.27 62.99,7.11 | CON3.2 57.76,7.21 57.66,7.11 | CON2.6 39.84,7.33 39.62,7.11 | CON2.2 34.76,7.15 34.8,7.11 | CON1.6 17.09,7.19 17.02,7.11
  Bottom 0.61: 37.08,42.42 41.4,42.42 59.18,42.42 64.26,42.42 82.04,42.42 87.12,42.42 92.2,42.42 97.79,36.83 97.79,13.21 91.69,7.11 85.85,7.11 80.77,7.11 62.99,7.11 57.66,7.11 39.62,7.11 34.8,7.11 17.02,7.11 10.16,7.11 8.89,8.38 8.89,10.67 10.43,12.2 CON1.2
N$56
  Top 0.762: IC1.6 61.59,25.78 61.41,25.6 61.41,25.59 60.4,24.59 C4.1
N$64
  Top 0.406: CON10.8 16.34,21.64
  Top 0.813: 16.34,21.64 D18.A | 18.32,26.71 D18.A | CON9.8 10.63,37.37 12.19,35.81 15.71,35.81 CON9.4 15.71,32.29 18.32,29.69 18.32,26.71 | CON10.4 18.32,26.71 | C14.1 23.11,24.99 | 23.11,24.99 D16.A | D18.A 22.94,25.16 23.11,24.99
N$67
  Top 0.813: D16.C 29.04,22.14 L1.2

### Text on the board
tNames: CAN | BT9.10 | BT13.14 | BT11.12 | CAN | UNIV 3.(1-3-5).x.x-rev5 | Button, / 1-Wire | 1Wire | GND | +5V | BT56 | BT78 | BT12 | BT34
bNames: hapcan.com